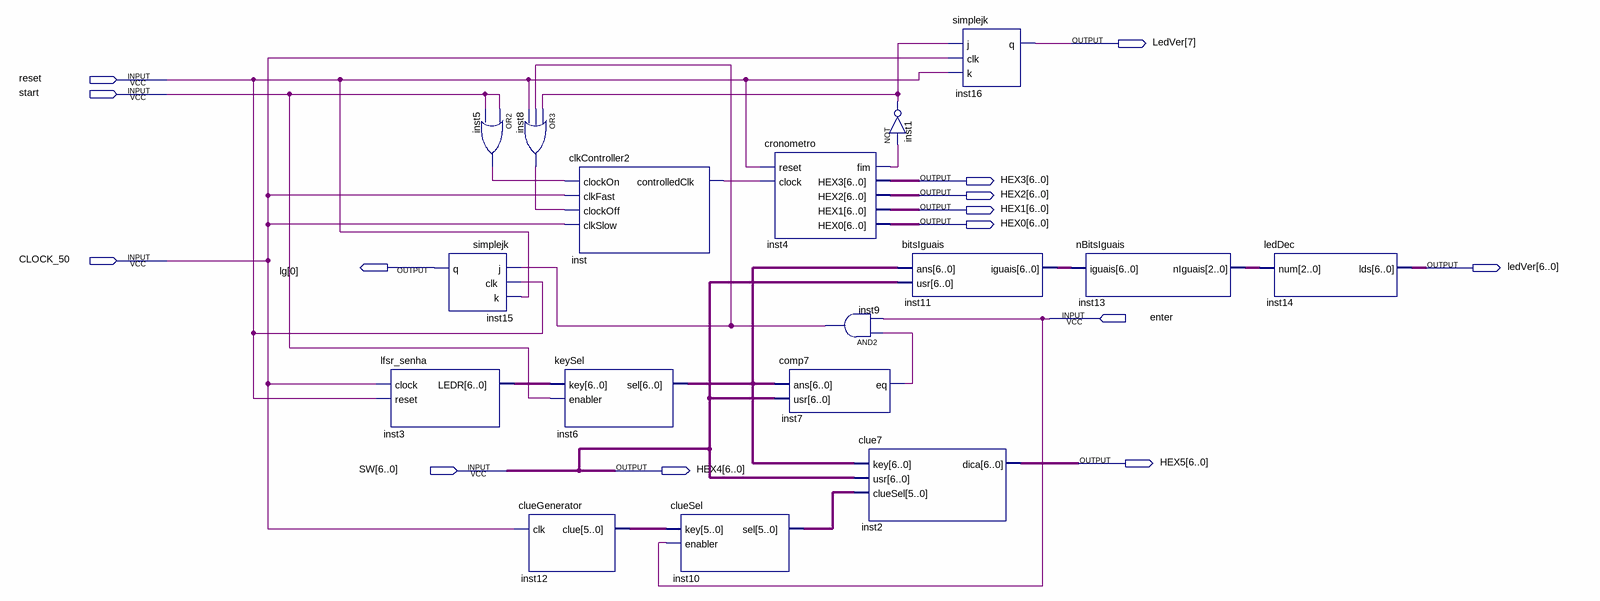
[diagram p0: schematic sheet]
// Quartus schematic ProjetoP.bdf as structural Verilog: 17 symbols, 14 pins
module ProjetoP (
  input  reset,
  input  start,
  input  CLOCK_50,
  input  enter,
  input  [6:0] SW,
  output [7:0] ledVer,
  output [6:0] HEX3,
  output [6:0] HEX2,
  output [6:0] HEX1,
  output [6:0] HEX0,
  output [0:0] lg,
  output [6:0] HEX5,
  output [6:0] HEX4
);

  wire inst1_out, inst4_fim, inst5_out, inst7_eq, inst8_out, inst9_out, inst_controlledclk;
  wire [2:0] inst13_niguais;
  wire [5:0] inst10_sel, inst12_clue;
  wire [6:0] inst3_ledr, inst6_sel, inst11_iguais;

  lfsr_senha inst3 (.clock(CLOCK_50), .reset(reset), .LEDR(inst3_ledr));
  or inst5 (inst5_out, start, start);
  simplejk inst15 (.j(inst9_out), .clk(reset), .k(reset), .q(lg[0]));
  or inst8 (inst8_out, inst1_out, inst9_out, reset);
  clueGenerator inst12 (.clk(CLOCK_50), .clue(inst12_clue));
  clkController2 inst (
    .clockOn(inst5_out), .clkFast(CLOCK_50), .clockOff(inst8_out), .clkSlow(CLOCK_50),
    .controlledClk(inst_controlledclk));
  keySel inst6 (.key(inst3_ledr), .enabler(start), .sel(inst6_sel));
  clueSel inst10 (.key(inst12_clue), .enabler(enter), .sel(inst10_sel));
  cronometro inst4 (
    .reset(reset), .clock(inst_controlledclk), .fim(inst4_fim), .HEX3(HEX3), .HEX2(HEX2), .HEX1(HEX1),
    .HEX0(HEX0));
  comp7 inst7 (.ans(inst6_sel), .usr(SW), .eq(inst7_eq));
  and inst9 (inst9_out, inst7_eq, enter);
  not inst1 (inst1_out, inst4_fim);
  clue7 inst2 (.key(inst6_sel), .usr(SW), .clueSel(inst10_sel), .dica(HEX5));
  simplejk inst16 (.j(inst1_out), .clk(CLOCK_50), .k(reset), .q(ledVer[7]));
  bitsIguais inst11 (.ans(inst6_sel), .usr(SW), .iguais(inst11_iguais));
  nBitsIguais inst13 (.iguais(inst11_iguais), .nIguais(inst13_niguais));
  ledDec inst14 (.num(inst13_niguais), .lds(ledVer[6:0]));

  assign HEX4 = SW;
endmodule
